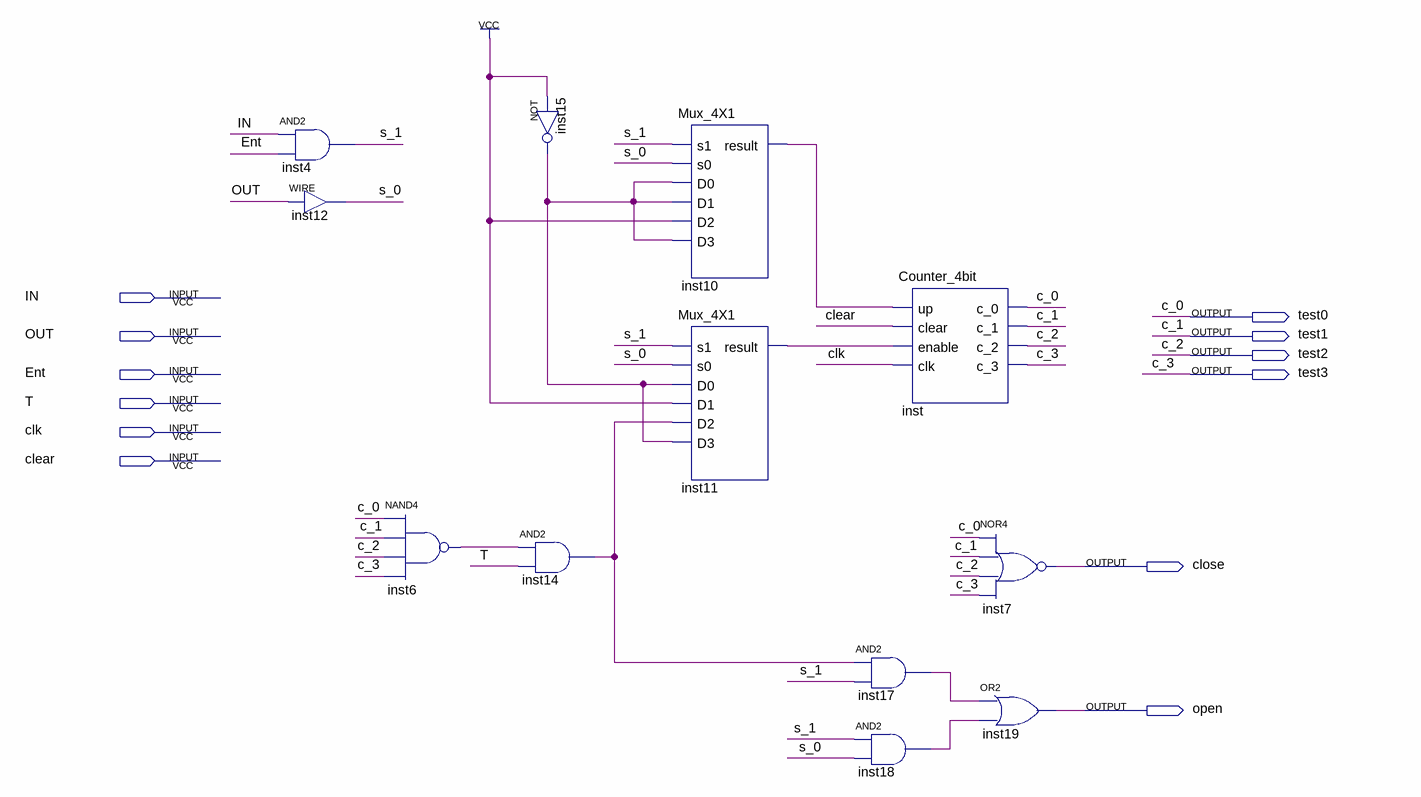
[diagram p0: schematic sheet]
// Quartus schematic top_module.bdf as structural Verilog: 12 symbols, 12 pins
module top_module (
  input  IN,
  input  OUT,
  input  Ent,
  input  T,
  input  clk,
  input  clear,
  output test0,
  output test1,
  output test2,
  output test3,
  output close,
  output open
);

  wire inst6_out, inst10_result, inst11_result, inst14_out, inst15_out, inst17_out, inst18_out, s_0, s_1;

  and inst4 (s_1, IN, Ent);
  assign s_0 = OUT;  // WIRE inst12
  nand inst6 (inst6_out, test0, test1, test2, test3);
  not inst15 (inst15_out, 1'b1);
  and inst14 (inst14_out, inst6_out, T);
  Mux_4X1 inst10 (
    .s1(s_1), .s0(s_0), .D0(inst15_out), .D1(inst15_out), .D2(1'b1), .D3(inst15_out), .result(inst10_result));
  Mux_4X1 inst11 (
    .s1(s_1), .s0(s_0), .D0(inst15_out), .D1(1'b1), .D2(inst14_out), .D3(inst15_out), .result(inst11_result));
  and inst17 (inst17_out, inst14_out, s_1);
  and inst18 (inst18_out, s_1, s_0);
  Counter_4bit inst (
    .up(inst10_result), .clear(clear), .enable(inst11_result), .clk(clk), .c_0(test0), .c_1(test1),
    .c_2(test2), .c_3(test3));
  nor inst7 (close, test0, test1, test2, test3);
  or inst19 (open, inst17_out, inst18_out);

  // Other names for the same wires on the sheet: c_0 = test0; c_1 = test1; c_2 = test2; c_3 = test3
endmodule
